# EAGLE design Wemos_MHZ19 (EAGLE 9.6.0)
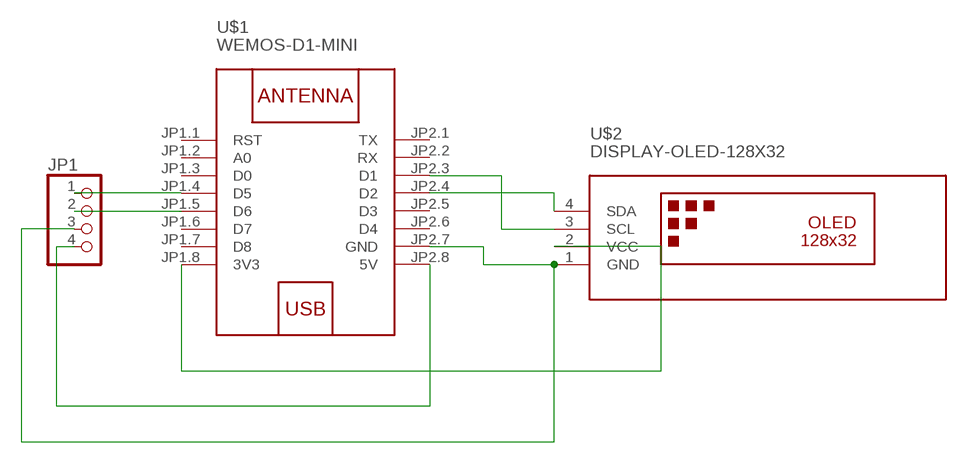
[diagram p0: schematic, sheet 1]

## Parts
JP1  PINHD-1X4/90  [1X04/90]
U$1  WEMOS-D1-MINI  [WEMOS-D1-MINI]
U$2  DISPLAY-OLED-128X32  [DISPLAY-OLED-128X32]

## Nets
N$1: JP1.3 U$1.JP2.7(GND) U$2.1(GND)
N$2: U$1.JP1.8(3V3) U$2.2(VCC)
N$3: U$1.JP2.4(D2) U$2.4(SDA)
N$4: U$1.JP2.3(D1) U$2.3(SCL)
N$5: JP1.4 U$1.JP2.8(5V)
N$7: JP1.2 U$1.JP1.5(D6)
N$8: JP1.1 U$1.JP1.4(D5)
Unconnected: U$1.JP1.1(RST) U$1.JP1.2(A0) U$1.JP1.3(D0) U$1.JP1.6(D7) U$1.JP1.7(D8) U$1.JP2.1(TX) U$1.JP2.2(RX) U$1.JP2.5(D3) U$1.JP2.6(D4)

## Library data of the parts
JP1 = pinhead:PINHD-1X4: PIN HEADER
U$1 = diy-modules:WEMOS-D1-MINI: WEMOS D1 mini: Mini Wi-Fi Board based on ESP-8266 device More details can be found here: https://www.wemos.cc/product/d1-mini.html Click here to find device on ebay.com <http://www.ebay.com/sch/wemos+d1+mini+nodemcu>
U$2 = diy-modules:DISPLAY-OLED-128X32: 128x32 Dot Matrix OLED Module with I2C interface based on SSD1306 chip More details available here: http://www.tinyosshop.com/index.php?route=product/product&product_id=953 Schematic available here: http://www.tinyosshop.com/datasheet/OLED%2012832.pdf SSD1306 datasheet: https://cdn-shop.adafruit.com/datasheets/SSD1306.pdf Click here to find device on ebay.com <http://www.ebay.com/sch/oled+display+128x32+i2c>

## Board
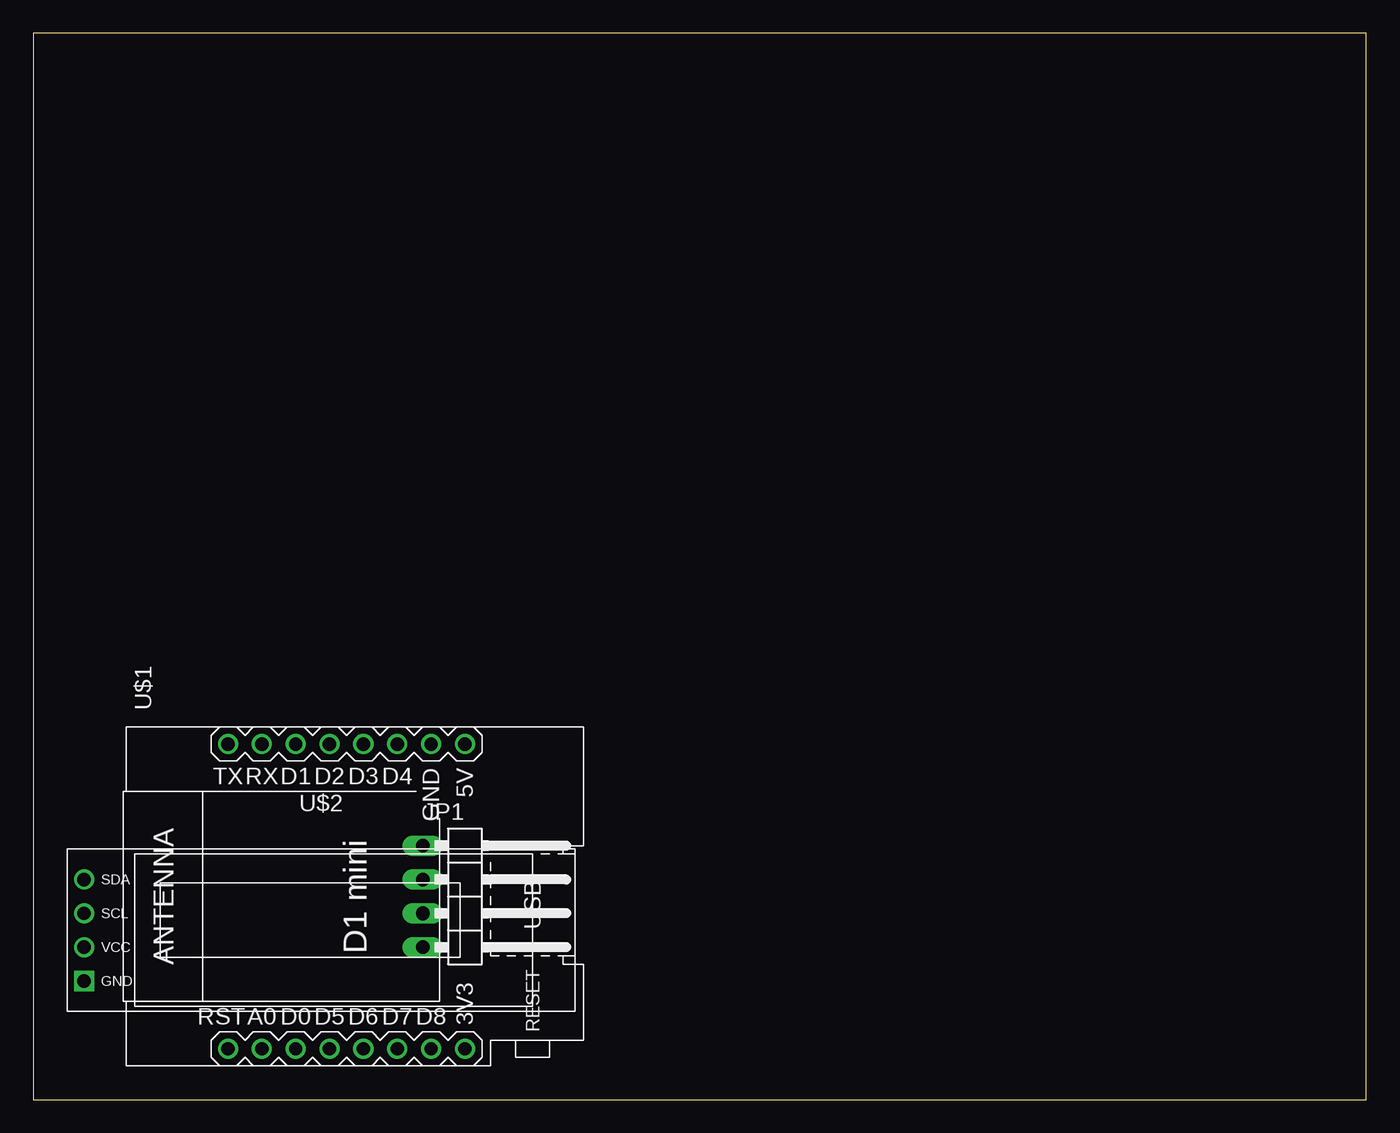
[diagram p1: board, top side]
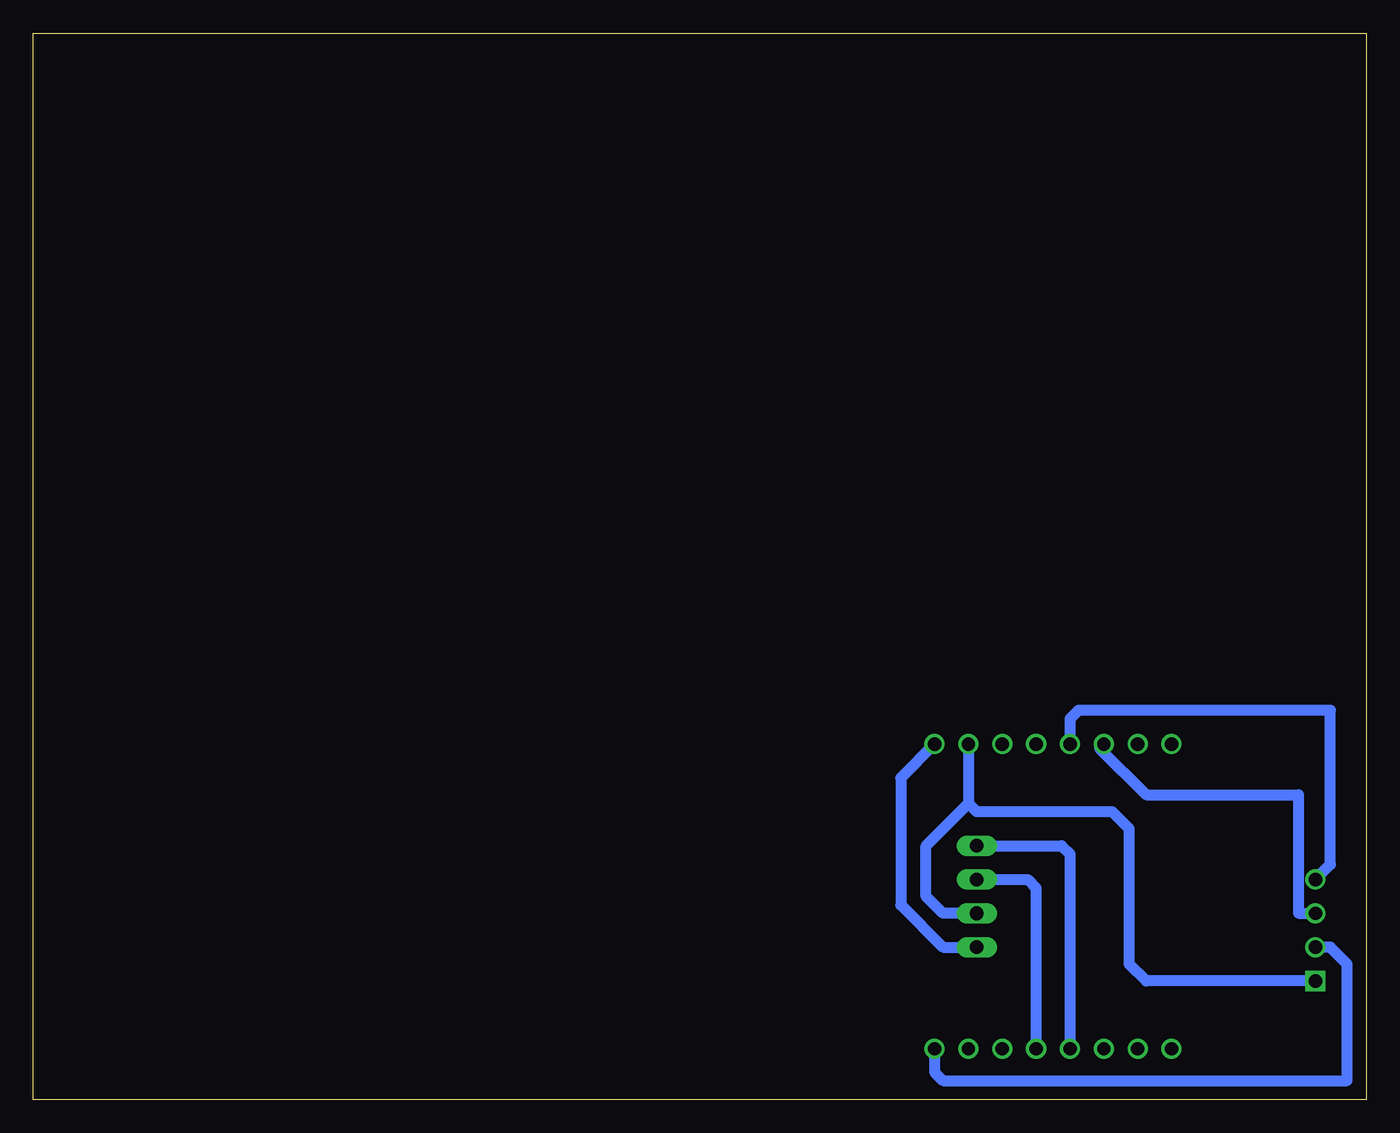
[diagram p2: board, bottom side, seen from below]

Size 100 x 80 mm. Coordinates in mm from the lower left corner, seen from the top.
Outline: 0,0 100,0 100,80 0,80 0,0
Copper layers (1*16): Top 0.035mm / dielectric 1.5mm / Bottom 0.035mm
Design rules "default": minimum track width 6mil, minimum drill 0.35mm, track to track 6mil, track to pad 6mil, pad to pad 6mil, via to via 6mil, smd to smd 6mil, copper to edge 40mil, drill to drill 6mil, minimum pad ring 10mil, minimum via ring 8mil, stop-mask expansion 4mil, vias tented up to drill 0mil, thermal gap 10mil

### Footprints (pad centres in the part's own frame; a part is rotated, then mirrored left to right if it is on the bottom)
1X04/90 = drill 1.016 long: 1 -3.81,-3.81; 2 -1.27,-3.81; 3 1.27,-3.81; 4 3.81,-3.81
WEMOS-D1-MINI = drill 1: JP1.1 -11.43,9.525; JP1.2 -11.43,6.985; JP1.3 -11.43,4.445; JP1.4 -11.43,1.905; JP1.5 -11.43,-0.635; JP1.6 -11.43,-3.175; JP1.7 -11.43,-5.715; JP1.8 -11.43,-8.255; JP2.1 11.43,9.525; JP2.2 11.43,6.985; JP2.3 11.43,4.445; JP2.4 11.43,1.905; JP2.5 11.43,-0.635; JP2.6 11.43,-3.175; JP2.7 11.43,-5.715; JP2.8 11.43,-8.255
DISPLAY-OLED-128X32 = drill 1 square: 1 -17.78,-3.81 | drill 1: 2 -17.78,-1.27; 3 -17.78,1.27; 4 -17.78,3.81

### Placement (x,y rotation side)
JP1  33.02,15.24 270 top
U$1  24.13,15.24 90 top
U$2  21.59,12.7 0 top

### Tracks (layer width: path | path; a pad name or v marks a point on that pad's centre or on a via)
N$1
  Bottom 0.813: U$1.JP2.7 29.84,22.23 | 29.84,22.23 33.02,19.05 33.02,15.24 31.75,13.97 JP1.3 | U$2.1 16.51,8.89 17.78,10.16 17.78,20.32 19.05,21.59 29.21,21.59 29.84,22.23
N$2
  Bottom 0.813: U$1.JP1.8 32.38,2.06 31.75,1.42 1.42,1.42 1.42,10.16 2.69,11.43 U$2.2
N$3
  Bottom 0.813: U$2.4 2.69,17.63 2.69,29.21 21.59,29.21 22.23,28.57 U$1.JP2.4
N$4
  Bottom 0.813: U$1.JP2.3 20,26.35 16.51,22.86 5.08,22.86 5.08,13.97 U$2.3
N$5
  Bottom 0.813: U$1.JP2.8 34.92,24.13 34.92,14.61 31.75,11.43 JP1.4
N$7
  Bottom 0.813: JP1.2 25.4,16.51 24.77,15.88 U$1.JP1.5
N$8
  Bottom 0.813: JP1.1 22.86,19.05 22.23,18.41 U$1.JP1.4